# Altium schematic sheet Scope Design.SchDoc
size A; SheetNumber: 4; SheetTotal: 10
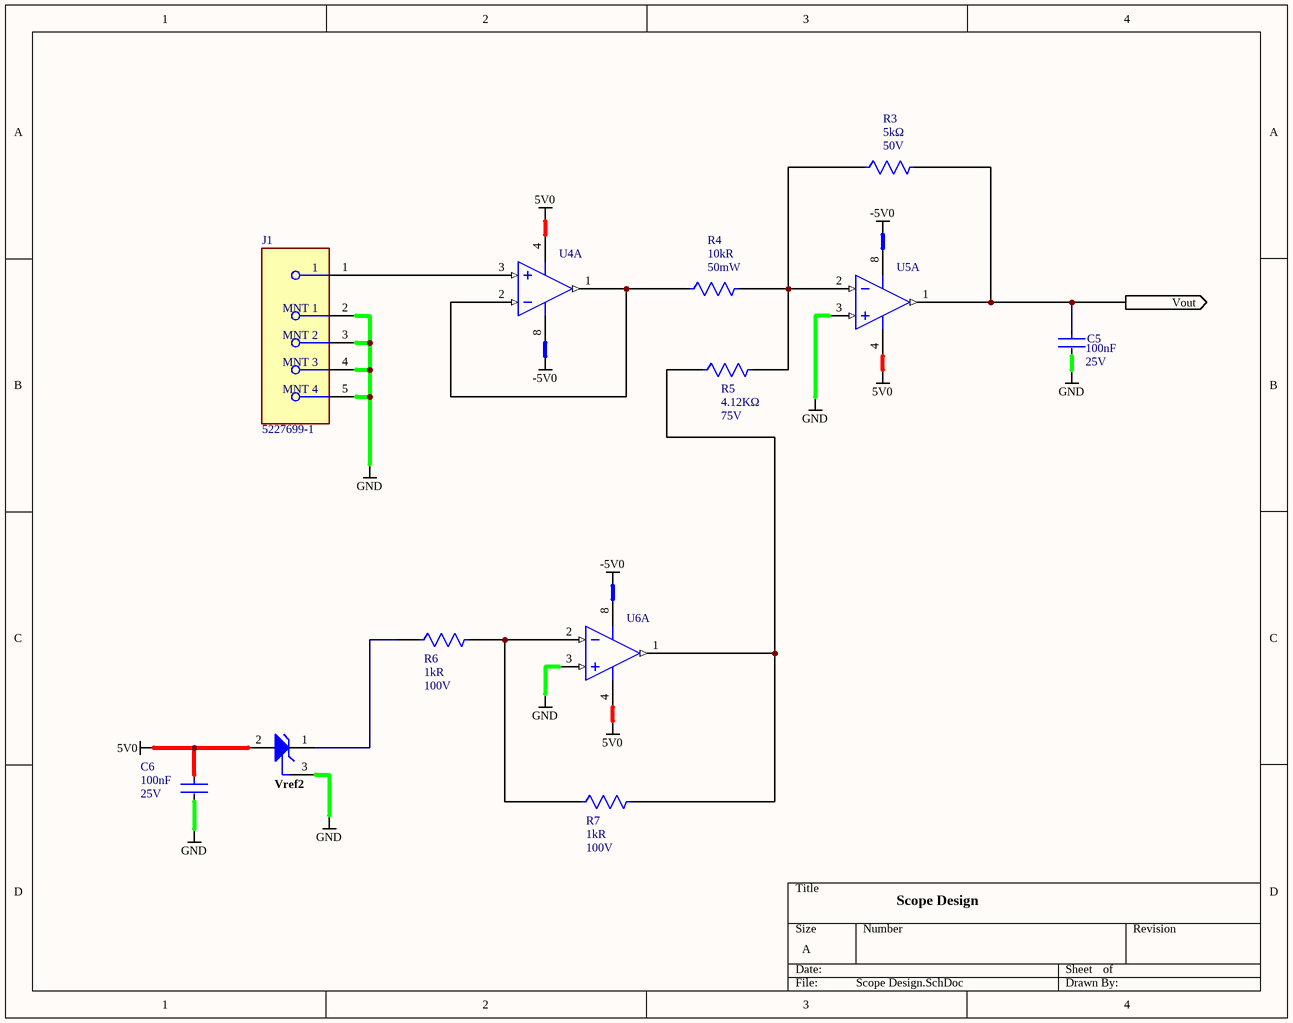
[diagram p0: Scope Design.SchDoc]

## Parts
C5  Voltage: 25V  Capacitance: 100nF  [FP-CL278-IPC_C]  (hidden comment: 0.1 uF)
C6  Voltage: 25V  Capacitance: 100nF  [FP-CL278-IPC_C]  (hidden comment: 0.1 uF)
J1  5227699-1  [FP-5227699-1-MFG]
R3  Resistance: 5kΩ  Voltage Rating: 50V  [FP-RC0402-MFG]  (hidden comment: RC0402FR-075KL)
R4  Max Power Dissipation: 50mW  Resistance: 10kR  [FP-RMCF0201-IPC_B]  (hidden comment: RMCF0201FT10K0)
R5  value 4.12KΩ  Voltage Rating: 75V  [FP-RQ731J-IPC_C]  (hidden comment: RQ73C1J4K12BTD)
R6  Resistance: 1kR  Voltage Rating: 100V  [FP-RG2012-IPC_B]  (hidden comment: RG2012P-102-B-T5)
R7  Resistance: 1kR  Voltage Rating: 100V  [FP-RG2012-IPC_B]  (hidden comment: RG2012P-102-B-T5)
U4  OPA2330AIDGKR  [DGK0008A_M]  (value not drawn)  (part A of 2)
U5  OPA2330AIDGKR  [DGK0008A_M]  (value not drawn)  (part A of 2)
U6  OPA2330AIDGKR  [DGK0008A_M]  (value not drawn)  (part A of 2)
Vref2  LM4040D20IDBZR  [DBZ0003A_N]  (value not drawn)

## Ports
Vout (out)

## Nets
5V0: C6.1 U4.4(V-) U5.4(V-) U6.4(V-) Vref2.2(ANODE)
-5V0: U4.8(V+) U5.8(V+) U6.8(V+)
GND: C5.2 C6.2 J1.2(MNT_1) J1.3(MNT_2) J1.4(MNT_3) J1.5(MNT_4) U5.3(IN_A+) U6.3(IN_A+) Vref2.3(NC)
Vout: C5.1 R3.2 U5.1(OUT_A) ; port Vout
NetJ1_1: J1.1 U4.3(IN_A+)
NetR3_1: R3.1 R4.2 R5.2 U5.2(IN_A-)
NetR4_1: R4.1 U4.1(OUT_A) U4.2(IN_A-)
NetR5_1: R5.1 R7.2 U6.1(OUT_A)
NetR6_1: R6.1 Vref2.1(CATHODE)
NetR6_2: R6.2 R7.1 U6.2(IN_A-)

## Notes on the sheet
- Scope Design

## Library data of the parts
C5 C6 = CMP-13271-000728-1: Cap Ceramic 100nF 25V X5R ±10% SMD 0402 +85°C Paper T/R; Package Quantity: 1; Height: 0.5mm; Case Code (Metric): 1005; Thickness: 0.022inch; Mount: Surface Mount; Lead Free: Lead Free; Case Code (Imperial): 0402; Packaging: Tape and Reel; Depth: 0.5mm; Min Operating Temperature: -55°C; Voltage Rating: 25V; Dielectric: X5R; Case/Package: 0402; Tolerance: 10%; Width: 0.02inch; Max Operating Temperature: 85°C; Length: 1mm; Radiation Hardening: No; Voltage Rating (DC): 25V
J1 = CMP-03357-000003-1: CONN BNC JACK STR 50 OHM PCB; Frequency: 4GHz; Number of Positions: 1; Body Plating: Nickel; Gender: Female; PCB Mount Retention: Without; Polarity: Standard; Body Material: Zinc; Voltage Rating: 500V; Sealable: No (Without); PCB Mounting Orientation: Vertical; Impedance: 50R; Insulation Resistance: 5GR; Orientation: Straight; Package Quantity: 30; ELV: Compliant; Min Operating Temperature: -55°C; Length: 17.45mm; Termination: Solder; Connector Type: BNC; Fastening Type: Bayonet; Contact Plating: Silver; Depth: 17.45mm; Contact Material: Bronze; Max Frequency: 4GHz; Max Operating Temperature: 85°C; Radiation Hardening: No; Mount: Through Hole; Lead Free: Lead Free; Packaging: Rail/Tube
R3 = CMP-03412-013078-1: RES SMD 5K OHM 1% 1/16W 0402; Manufacturer: Yageo; Temperature Coefficient: 100ppm/°C; Power Rating: 0.0625W; Value: 5kΩ; Temperature Range Low: -55°C; Lead Free: Yes; RoHS: TRUE; Device Class L2: Resistors; Package: RC0402; Footprint Url: https://pccomponents.com/datasheets/YAGEO-20RESISTORS.PDF; Height: 0.4mm; ComponentLink2URL: http://www.yageo.com/documents/recent/PYu-RC_Group_51_RoHS_L_10.pdf; Temperature: -55°C to +155°C; Composition: Thick Film; Device Class L1: Passive Components; Series: RC_L; Ipc Land Pattern Name: RESC10050X35; Tolerance: 1%; Device Class L3: Chip SMD Resistors; Temperature Range High: +155°C; Category: Res; Automotive: No; Octopart: https://octopart.com/rc0402fr-075kl-yageo-25450038; Digikey Description: RES SMD 5K OHM 1% 1/16W 0402; ComponentLink2Description: Datasheet; Manufacturer Part Number: RC0402FR-075KL
R4 = CMP-26527-002755-1: RES 10K OHM 1% 1/20W 0201; Temperature Coefficient: 200ppm/°C; Length: 0.024inch; Min Operating Temperature: -55°C; Width: 0.012inch; Contact Plating: Tin; Case/Package: 0201; Power Rating: 50mW; Packaging: Tape and Reel; Resistor Type: Thick Film; Case Code (Metric): 0603; Tolerance: 1%; Case Code (Imperial): 0201; Max Operating Temperature: 125°C; Height: 0.009inch; Mount: Surface Mount; Series: RMCF; RoHS Compliant: Yes; Number of Terminations: 2
R5 = CMP-03211-008606-1: RQ73 0603 4.12KΩ  0.15W 10ppm/°C 0.1% 75V; Manufacturer: TE; Automotive Grade: Grade 0; Height: 0.6mm; Octopart: https://octopart.com/rq73c1j4k12btd-te+connectivity-93908885; Temperature Coefficient: 10ppm/°C; Power Rating: 0.15W; Device Class L2: Resistors; Temperature Range Low: -55°C; Temperature Range High: +155°C; Ipc Land Pattern Name: RESC15580X45; Package: RQ731J; ComponentLink2URL: https://www.te.com/commerce/DocumentDelivery/DDEController?Action=showdoc&DocId=Data+Sheet%7F1773270-2%7FA%7Fpdf%7FEnglish%7FENG_DS_1773270-2_A.pdf%7F4-2176362-2; Tolerance: 0.1%; Device Class L1: Passive Components; Composition: Thin Film; ComponentLink2Description: Datasheet; Lead Free: Yes; Series: RQ73; Category: Res; Device Class L3: Chip SMD Resistors; Resistance: 4.12KΩ; Manufacturer Part Number: RQ73C1J4K12BTD; RoHS: TRUE; Automotive: Yes; Temperature: -55°C to +155°C
R6 R7 = CMP-2001-02697-2: Automotive Metal Thin Film Chip Resistor, 0805, 1kΩ, 0.1%, 25ppm/°C, 0.125W, 150V; Power Rating: 100mW; Max Power Dissipation: 125mW; RoHS Compliant: Yes; Length: 0.079inch; Case Code (Metric): 2012; Width: 0.049inch; Case/Package: 0805; Height: 0.02inch; Max Operating Temperature: 155°C; Package Quantity: 1; Tolerance: 0.1%; Case Code (Imperial): 0805; Number of Terminations: 2; Lead Free: Lead Free; Temperature Coefficient: 25ppm/°C; Working Voltage: 150V; Features: Automotive AEC-Q200; Packaging: Tape and Reel; Resistor Type: Thin Film; Voltage Rating (DC): 150V; Termination: SMD/SMT; Series: RG; Technology: THIN FILM; Min Operating Temperature: -55°C
U4-U6 = CMP-0272-01264-3: 35 uA, MicroPower, Precision, Zero Drift CMOS Operational Amplifier, 1.8 to 5.5 V, -40 to 125 degC, 8-pin SOP (DGK8), Green (RoHS & no Sb/Br); Manufacturer: Texas Instruments; Total Supply Voltage(Max)(+5V is 5, +/-5V is 10): 5.5; CMRR(Min)(dB): 100; Number of Channels: 2; IIB(Max)(pA): 500; Total Supply Voltage(Min)(+5V is 5, +/-5V is 10): 1.8; Sub Family: Low Offset Voltage Amplifier (<=500uV), Low Power Amp (<=500uA), Low Supply Voltage Amplifier (<=2.7V), Precision Amplifier, Zero Drift Precision Amplifier; Offset Drift(Typ)(uV/C): 0.02; Slew Rate(Typ)(V/us): 0.16; Vn at 1kHz(Typ)(nV/rtHz): 55; Iq per channel(Max)(mA): 0.035; Vio (25C)(Max)(mV): 0.05; PackageReference: DGK0008A; ComponentLink3Description: Package Specification; Mounting Technology: Surface Mount; DatasheetVersion: SBOS432E; PackageVersion: 4073329/E, 05/2006; PackageDescription: 8-Pin Thin Small Outline, Body 3 x 3 mm, Pitch 0.65 mm; ComponentLink2URL: http://www.ti.com/general/docs/lit/getliterature.tsp?genericPartNumber=OPA2330&fileType=pdf; ComponentLink1URL: http://www.ti.com/; Eco-Plan: Green (RoHS & no Sb/Br); Code_JEDEC: MO-187; ComponentLink2Description: Datasheet; ComponentLink3URL: http://www.ti.com/litv/pdf/mpds028d; PartNumber: OPA2330AIDGKR; ComponentLink1Description: Manufacturer URL
Vref2 = CMP-0366-00999-2: Precision Micropower Shunt Voltage Reference, 1% accuracy, 2.048 V, 15 ppm / degC, 15 mA, -40 to 85 degC, 3-pin SOT-23 (DBZ), Green (RoHS & no Sb/Br); Manufacturer: Texas Instruments; Rating: Catalog; Min Iz for Regulation(uA): 75; VO(V): 2.048; Iout/Iz(Max)(mA): 15; Initial Accuracy @ 25/deg C(%): 1; Temp Coeff(Max)(ppm/ degree C): 150; ComponentLink2Description: Datasheet; Mounting Technology: Surface Mount; SubFamily: Shunt Voltage Reference; PackageDescription: 3-Pin Plastic Small Outline, Body 2.92 x 1.3 mm, Pitch 0.95 mm; ComponentLink3URL: http://www.ti.com/litv/pdf/mpds108a; ComponentLink1URL: http://www.ti.com/; PackageReference: DBZ0003A; Code_JEDEC: TO-236; DatasheetVersion: SLOS456K; PartNumber: LM4040D20IDBZR; ComponentLink3Description: Package Specification; ComponentLink1Description: Manufacturer URL; ComponentLink2URL: http://www.ti.com/general/docs/lit/getliterature.tsp?genericPartNumber=LM4040D20&fileType=pdf; Eco-Plan: Green (RoHS & no Sb/Br); Temp Coeff(Typ)(ppm/ degree C): 15; PackageVersion: 4203227/B